# EAGLE schematic Test_Schematic (EAGLE 9.6.2)
PROJECT_NAME: TEST_PROJECT
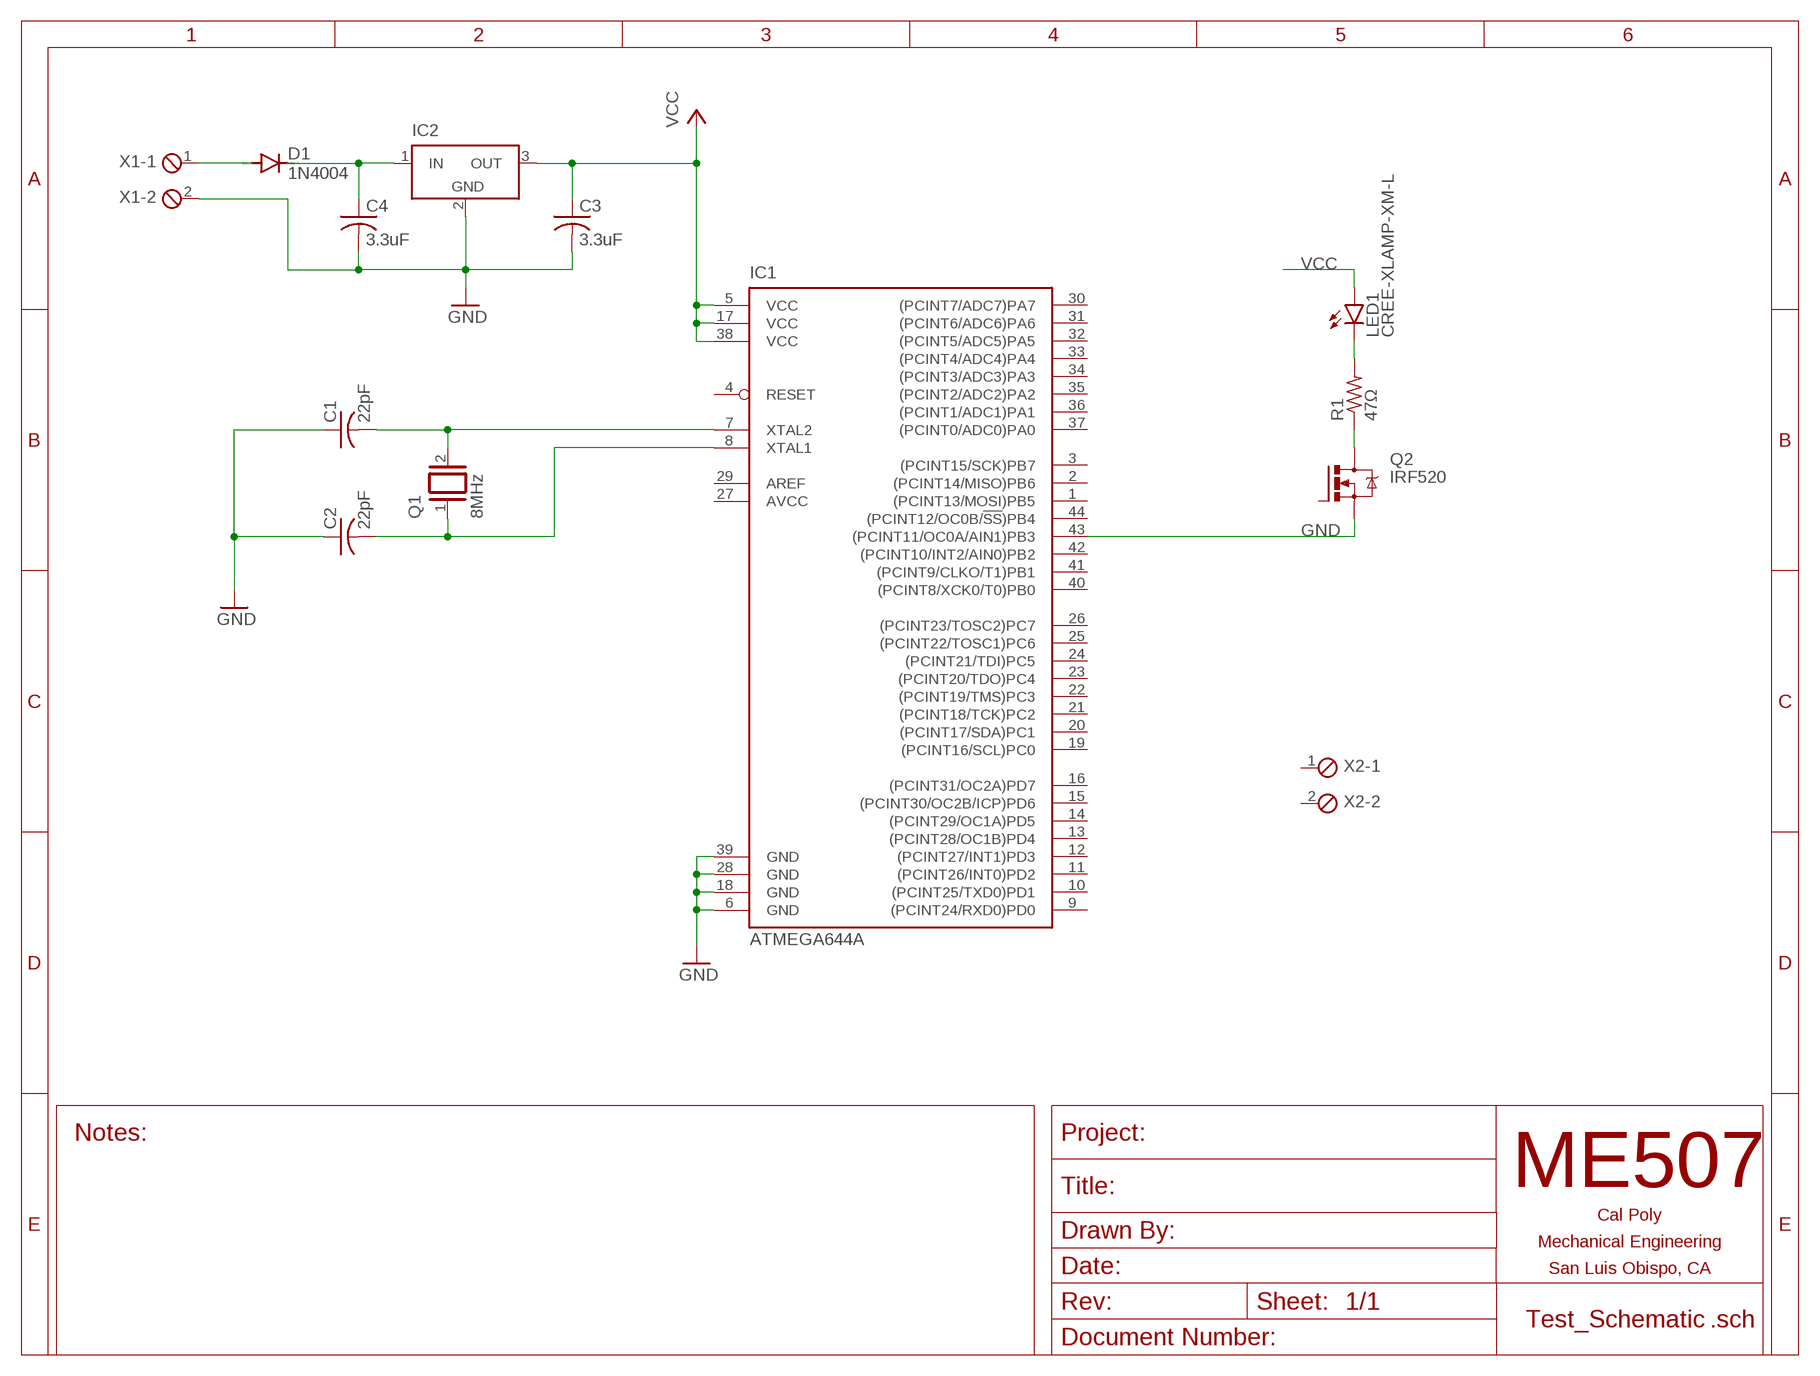
[diagram p0: schematic, sheet 1]

## Parts
C1  22pF  C-USC0805  [C0805]
C2  22pF  C-USC0805  [C0805]
C3  3.3uF  C-USC0805  [C0805]
C4  3.3uF  C-USC0805  [C0805]
D1  1N4004  [DO41-10]
IC1  ATMEGA644A  [TQFP44]
IC2  LT1129CST5  [SOT223]
LED1  CREE-XLAMP-XM-L  [CREE-XLAMP-XM-L]
Q1  8MHz  XTAL/S  [QS]
Q2  IRF520  [TO220BV]
R1  47Ω  R-US_0309/V  [0309V]
X1  SCREWTERM_2P_254  [2POL254]
X2  SCREWTERM_2P_254  [2POL254]

## Nets
GND: C1.1 C2.1 C3.2 C4.2 IC1.6(GND) IC1.18(GND) IC1.28(GND) IC1.39(GND) IC1.43((PCINT11/OC0A/AIN1)PB3) IC2.2(GND) Q2.S X1.2
N$2: C2.2 IC1.8(XTAL1) Q1.1
N$3: Q2.D R1.1
N$4: LED1.C LED1.C@1(C) R1.2
N$5: C4.1 D1.C IC2.1(IN)
N$6: D1.A X1.1
N$7: C1.2 IC1.7(XTAL2) Q1.2
VCC: C3.1 IC1.5(VCC) IC1.17(VCC) IC1.38(VCC) IC2.3(OUT) LED1.A LED1.A@1(A)
Unconnected: IC1.1((PCINT13/MOSI)PB5) IC1.2((PCINT14/MISO)PB6) IC1.3((PCINT15/SCK)PB7) IC1.4(RESET) IC1.9((PCINT24/RXD0)PD0) IC1.10((PCINT25/TXD0)PD1) IC1.11((PCINT26/INT0)PD2) IC1.12((PCINT27/INT1)PD3) IC1.13((PCINT28/OC1B)PD4) IC1.14((PCINT29/OC1A)PD5) IC1.15((PCINT30/OC2B/ICP)PD6) IC1.16((PCINT31/OC2A)PD7) IC1.19((PCINT16/SCL)PC0) IC1.20((PCINT17/SDA)PC1) IC1.21((PCINT18/TCK)PC2) IC1.22((PCINT19/TMS)PC3) IC1.23((PCINT20/TDO)PC4) IC1.24((PCINT21/TDI)PC5) IC1.25((PCINT22/TOSC1)PC6) IC1.26((PCINT23/TOSC2)PC7) IC1.29(AREF) IC1.30((PCINT7/ADC7)PA7) IC1.31((PCINT6/ADC6)PA6) IC1.32((PCINT5/ADC5)PA5) IC1.33((PCINT4/ADC4)PA4) IC1.34((PCINT3/ADC3)PA3) IC1.35((PCINT2/ADC2)PA2) IC1.36((PCINT1/ADC1)PA1) IC1.37((PCINT0/ADC0)PA0) IC1.40((PCINT8/XCK0/T0)PB0) IC1.41((PCINT9/CLKO/T1)PB1) IC1.42((PCINT10/INT2/AIN0)PB2) IC1.44((PCINT12/OC0B/!SS!)PB4) Q2.G X2.1 X2.2

## Power pins joined to a net without a drawn wire
AVCC: IC1.27(AVCC)
GND: IC2.4(GND)

## Library data of the parts
C1-C4 = rcl:C-US: CAPACITOR, American symbol; SPICEPREFIX: C
D1 = diode:1N4004: DIODE general purpose rectifier, 1 A
IC1 = atmel:ATMEGA644: 8-bit Microcontroller with 64K Bytes In-System Programmable Flash Source: http://www.atmel.com/dyn/resources/prod_documents/doc2593.pdf; MPN: ATMEGA644PV-10AU; OC_FARNELL: 1455123; OC_NEWARK: 58M3748
IC2 = linear-technology:LT1129CST5: VOLTAGE REGULATOR with shutdown; MPN: LT1129CST-5#PBF; OC_FARNELL: 1663375; OC_NEWARK: 57M2069
LED1 = led:CREE-XLAMP-XM-L: Cree® XLamp® XM-L LEDs Source: http://www.cree.com
Q1 = special:XTAL/S: CRYSTAL
Q2 = transistor-power:IRF520: HEXFET Power MOSFET
R1 = rcl:R-US_: RESISTOR, American symbol; SPICEPREFIX: R
X1 X2 = ME507:SCREWTERM_2P: Screw Terminal Block This part is designed for a screw terminal connector. The 2.54mm (0.100 inch) foorprint can also be used for male or female pin headers such as those on most development boards. One can also solder wires directly into the holes, though this makes modifications or repairs to the system more inconvenient. Larger versions can carry more current.